# EAGLE design uMatrixPCB_r1 (EAGLE 6.5.0)
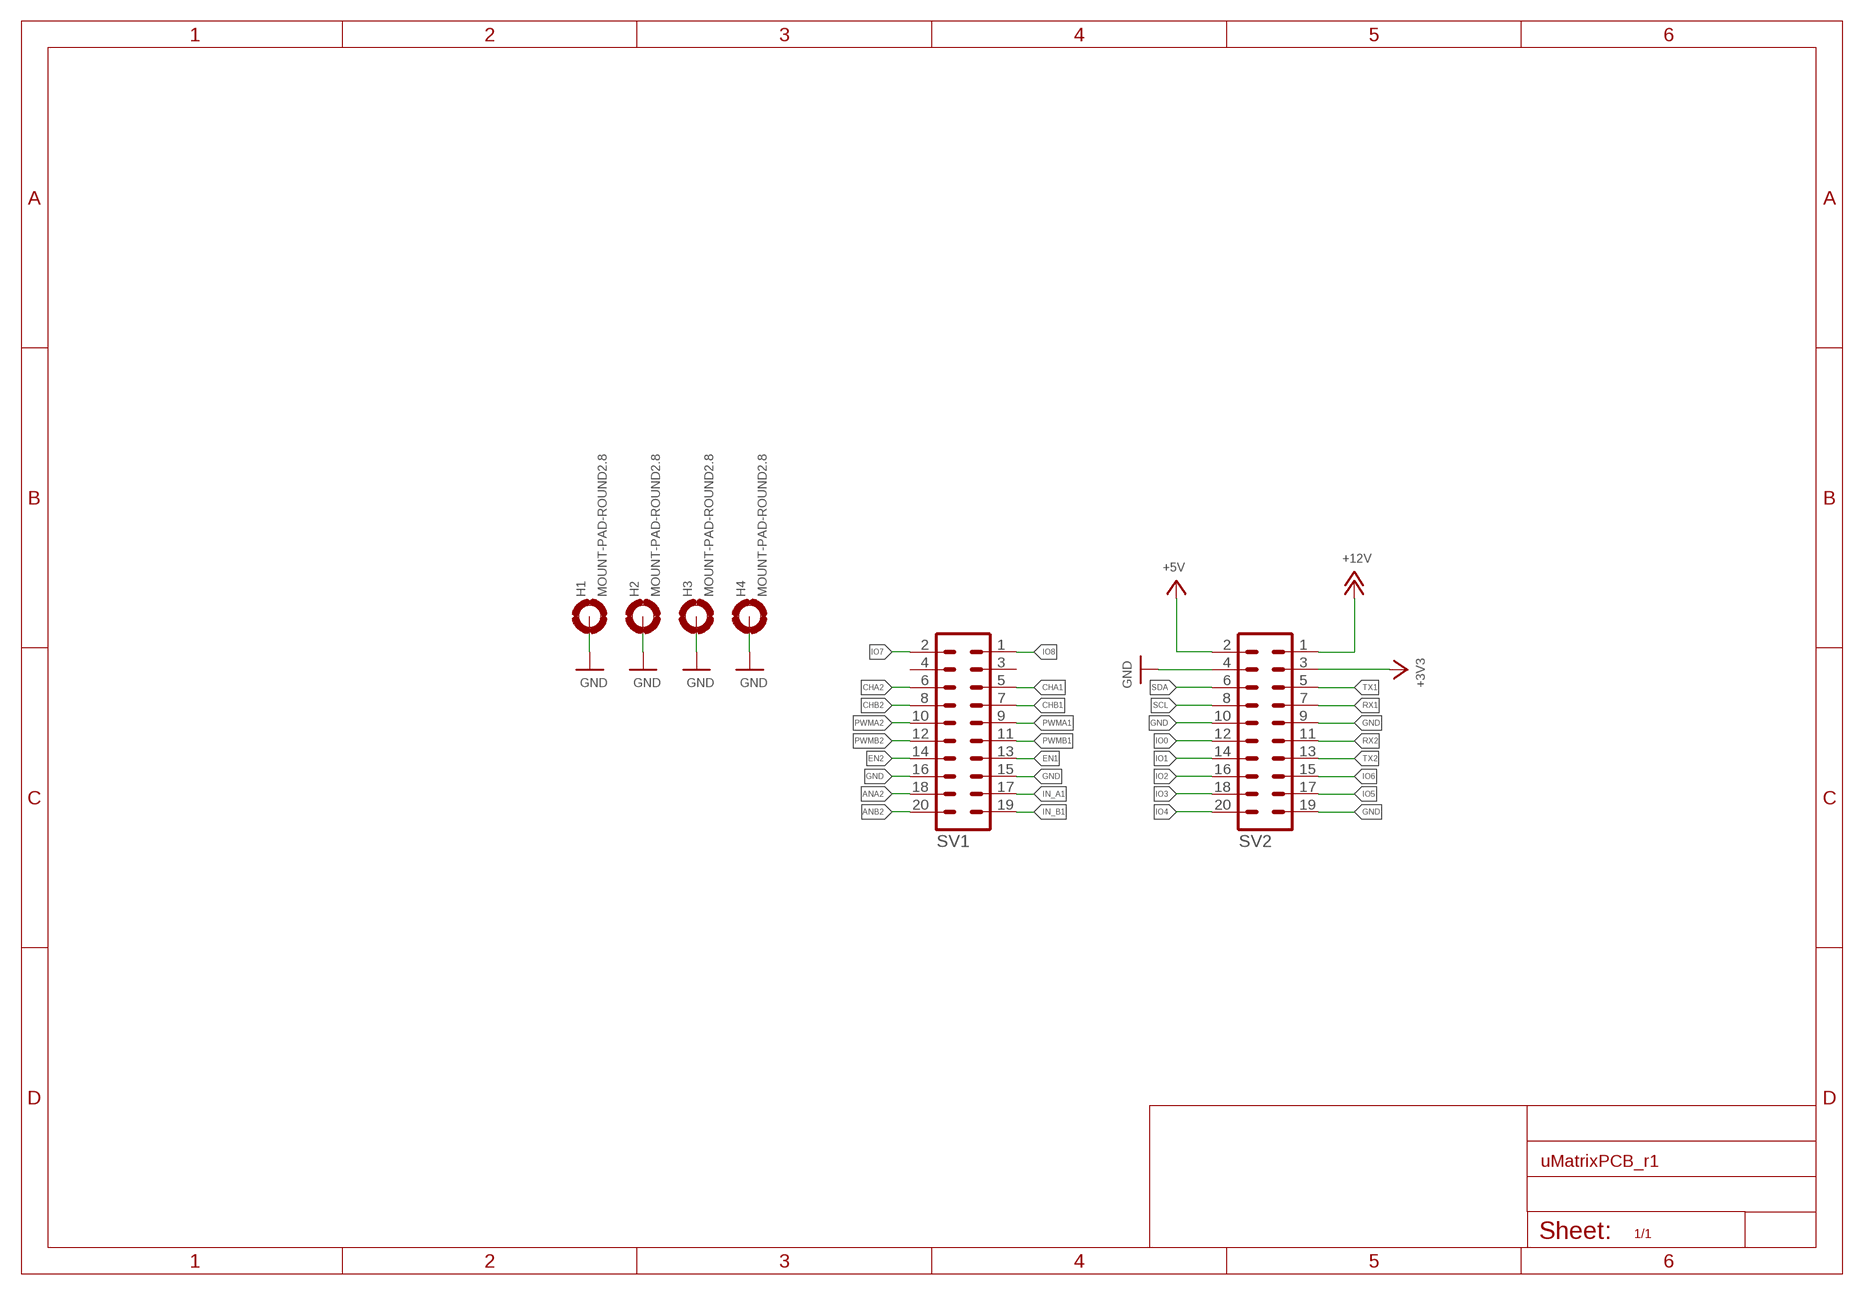
[diagram p0: schematic, sheet 1]

## Parts
H1  MOUNT-PAD-ROUND2.8  [2,8-PAD]
H2  MOUNT-PAD-ROUND2.8  [2,8-PAD]
H3  MOUNT-PAD-ROUND2.8  [2,8-PAD]
H4  MOUNT-PAD-ROUND2.8  [2,8-PAD]
SV1  MA10-2  [MA10-2]
SV2  MA10-2  [MA10-2]

## Nets
+3V3: SV2.3
+5V: SV2.2
+12V: SV2.1
ANA2: SV1.18
ANB2: SV1.20
CHA1: SV1.5
CHA2: SV1.6
CHB1: SV1.7
CHB2: SV1.8
EN1: SV1.13
EN2: SV1.14
GND: H1.B2,8(MOUNT) H2.B2,8(MOUNT) H3.B2,8(MOUNT) H4.B2,8(MOUNT) SV1.15 SV1.16 SV2.4 SV2.9 SV2.10 SV2.19
IN_A1: SV1.17
IN_B1: SV1.19
IO0: SV2.12
IO1: SV2.14
IO2: SV2.16
IO3: SV2.18
IO4: SV2.20
IO5: SV2.17
IO6: SV2.15
IO7: SV1.2
IO8: SV1.1
PWMA1: SV1.9
PWMA2: SV1.10
PWMB1: SV1.11
PWMB2: SV1.12
RX1: SV2.7
RX2: SV2.11
SCL: SV2.8
SDA: SV2.6
TX1: SV2.5
TX2: SV2.13
Unconnected: SV1.3 SV1.4

## Library data of the parts
H1-H4 = holes:MOUNT-PAD-ROUND: MOUNTING PAD, round
SV1 SV2 = con-lstb:MA10-2: PIN HEADER; OC_FARNELL: unknown; OC_NEWARK: unknown

## Net classes
0 default: width 0.254 mm, drill 0.406 mm, clearance 0.178 mm
1 power: width 0.305 mm, drill 0.406 mm, clearance 0.203 mm

## Board
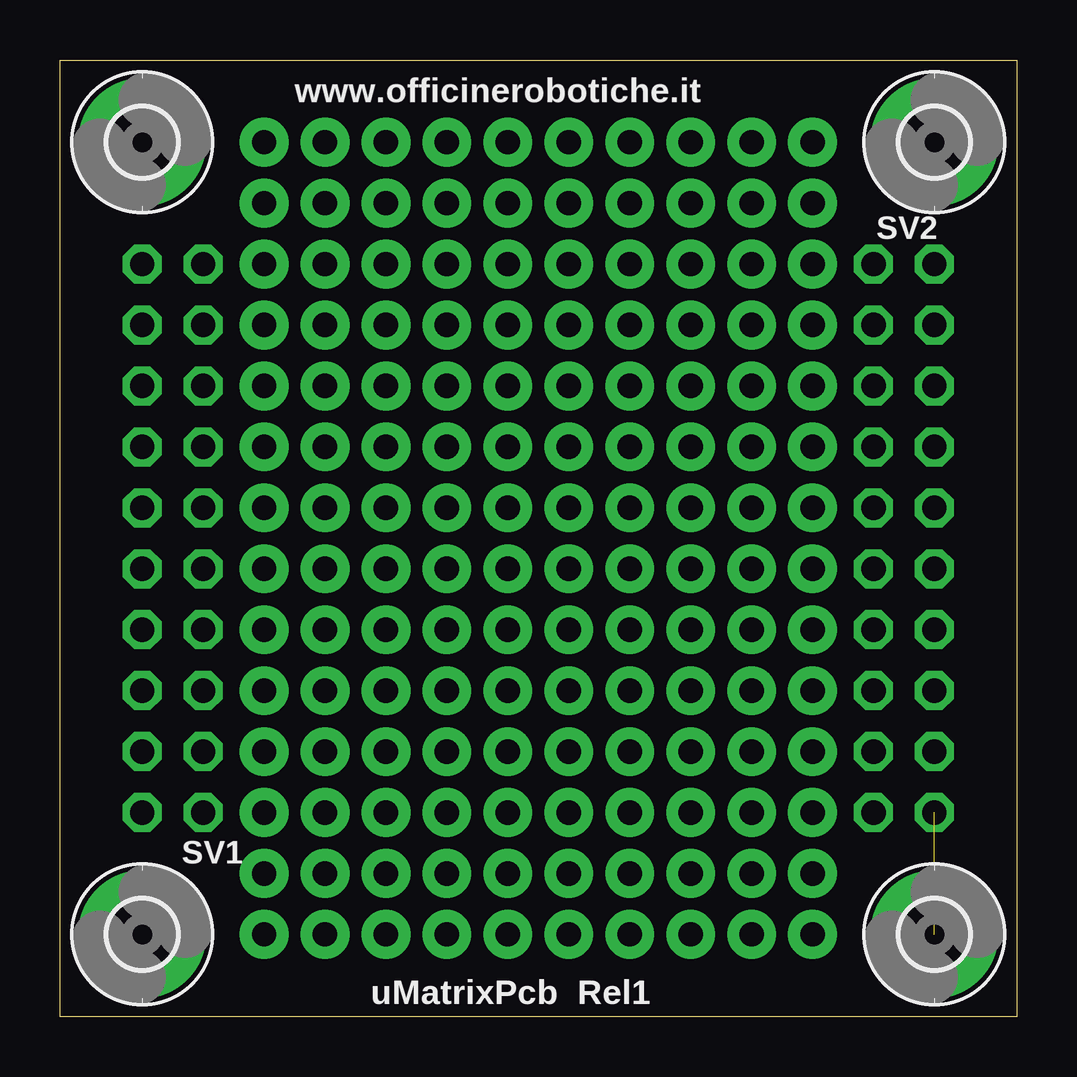
[diagram p1: board, top side]
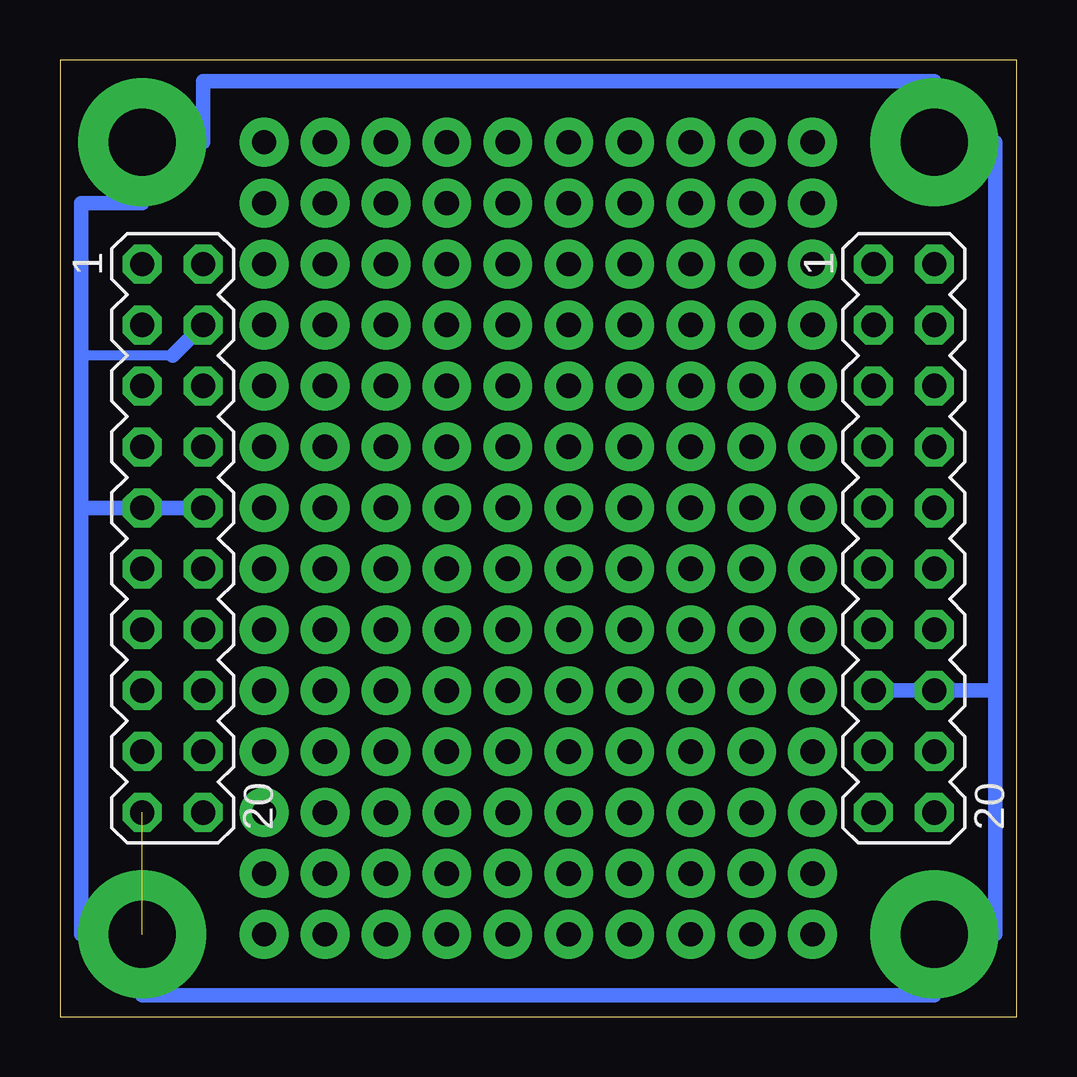
[diagram p2: board, bottom side, seen from below]

Size 39.88 x 39.88 mm. Coordinates in mm from the lower left corner, seen from the top.
Outline: 39.88,0 0,0 0,39.88 39.88,39.88 39.88,0
Copper layers (1*16): Top 0.035mm / dielectric 1.5mm / Bottom 0.035mm
Design rules "default": minimum track width 8mil, minimum drill 12mil, track to track 8mil, track to pad 8mil, pad to pad 8mil, via to via 8mil, smd to smd 8mil, copper to edge 10mil, drill to drill 8mil, minimum pad ring 12mil, minimum via ring 8mil, stop-mask expansion 4mil, vias tented up to drill 20mil, thermal gap 10mil

### Footprints (pad centres in the part's own frame; a part is rotated, then mirrored left to right if it is on the bottom)
2,8-PAD = drill 2.8 pad 5.334: B2,8 0,0
MA10-2 = drill 1.016 octagon: 1 -11.43,-1.27; 2 -11.43,1.27; 3 -8.89,-1.27; 4 -8.89,1.27; 5 -6.35,-1.27; 6 -6.35,1.27; 7 -3.81,-1.27; 8 -3.81,1.27; 9 -1.27,-1.27; 10 -1.27,1.27; 11 1.27,-1.27; 12 1.27,1.27; 13 3.81,-1.27; 14 3.81,1.27; 15 6.35,-1.27; 16 6.35,1.27; 17 8.89,-1.27; 18 8.89,1.27; 19 11.43,-1.27; 20 11.43,1.27

### Placement (x,y rotation side)
H1  3.43,3.43 0 top
H2  36.45,3.43 0 top
H3  36.45,36.45 0 top
H4  3.43,36.45 0 top
SV1  4.7,19.94 270 bottom
SV2  35.18,19.94 270 bottom

### Tracks (layer width: path | path; a pad name or v marks a point on that pad's centre or on a via)
GND  (1 unrouted)
  Bottom 0.406: 35.18,27.56 38.99,27.56
  Bottom 0.61: 0.89,13.59 0.89,36.45 H4.B2,8 3.43,38.99 33.91,38.99 33.91,36.45 H3.B2,8 36.45,33.91 38.99,33.91 38.99,27.56 38.99,21.21 | 0.89,13.59 SV1.16 SV1.15 | 0.89,13.59 0.89,3.43 H1.B2,8 3.43,0.89 36.45,0.89 H2.B2,8 38.99,3.43 38.99,21.21 | 38.99,21.21 SV2.9 SV2.10 | SV2.4 35.18,27.56
N$1  (via drill 1.02 pad 2.03)
  other vias: 8.51,3.43
N$2  (via drill 1.02 pad 2.03)
  other vias: 11.05,3.43
N$3  (via drill 1.02 pad 2.03)
  other vias: 16.13,3.43
N$4  (via drill 1.02 pad 2.03)
  other vias: 13.59,3.43
N$5  (via drill 1.02 pad 2.03)
  other vias: 18.67,3.43
N$6  (via drill 1.02 pad 2.03)
  other vias: 21.21,3.43
N$7  (via drill 1.02 pad 2.03)
  other vias: 23.75,3.43
N$8  (via drill 1.02 pad 2.03)
  other vias: 26.29,3.43
N$9  (via drill 1.02 pad 2.03)
  other vias: 8.51,23.75
N$10  (via drill 1.02 pad 2.03)
  other vias: 8.51,26.29
N$11  (via drill 1.02 pad 2.03)
  other vias: 8.51,28.83
N$12  (via drill 1.02 pad 2.03)
  other vias: 8.51,31.37
N$13  (via drill 1.02 pad 2.03)
  other vias: 8.51,33.91
N$14  (via drill 1.02 pad 2.03)
  other vias: 8.51,36.45
N$15  (via drill 1.02 pad 2.03)
  other vias: 11.05,36.45
N$16  (via drill 1.02 pad 2.03)
  other vias: 13.59,36.45
N$17  (via drill 1.02 pad 2.03)
  other vias: 16.13,36.45
N$18  (via drill 1.02 pad 2.03)
  other vias: 18.67,36.45
N$19  (via drill 1.02 pad 2.03)
  other vias: 21.21,36.45
N$20  (via drill 1.02 pad 2.03)
  other vias: 23.75,36.45
N$21  (via drill 1.02 pad 2.03)
  other vias: 26.29,36.45
N$22  (via drill 1.02 pad 2.03)
  other vias: 28.83,36.45
N$23  (via drill 1.02 pad 2.03)
  other vias: 31.37,36.45
N$24  (via drill 1.02 pad 2.03)
  other vias: 31.37,33.91
N$25  (via drill 1.02 pad 2.03)
  other vias: 28.83,33.91
N$26  (via drill 1.02 pad 2.03)
  other vias: 26.29,33.91
N$27  (via drill 1.02 pad 2.03)
  other vias: 23.75,33.91
N$28  (via drill 1.02 pad 2.03)
  other vias: 21.21,33.91
N$29  (via drill 1.02 pad 2.03)
  other vias: 16.13,33.91
N$30  (via drill 1.02 pad 2.03)
  other vias: 18.67,33.91
N$31  (via drill 1.02 pad 2.03)
  other vias: 13.59,33.91
N$32  (via drill 1.02 pad 2.03)
  other vias: 11.05,33.91
N$33  (via drill 1.02 pad 2.03)
  other vias: 11.05,31.37
N$34  (via drill 1.02 pad 2.03)
  other vias: 13.59,31.37
N$35  (via drill 1.02 pad 2.03)
  other vias: 16.13,31.37
N$36  (via drill 1.02 pad 2.03)
  other vias: 18.67,31.37
N$37  (via drill 1.02 pad 2.03)
  other vias: 21.21,31.37
N$38  (via drill 1.02 pad 2.03)
  other vias: 23.75,31.37
N$39  (via drill 1.02 pad 2.03)
  other vias: 26.29,31.37
N$40  (via drill 1.02 pad 2.03)
  other vias: 28.83,31.37
N$41  (via drill 1.02 pad 2.03)
  other vias: 31.37,31.37
N$42  (via drill 1.02 pad 2.03)
  other vias: 31.37,28.83
N$43  (via drill 1.02 pad 2.03)
  other vias: 28.83,28.83
N$44  (via drill 1.02 pad 2.03)
  other vias: 26.29,28.83
N$45  (via drill 1.02 pad 2.03)
  other vias: 23.75,28.83
N$46  (via drill 1.02 pad 2.03)
  other vias: 21.21,28.83
N$47  (via drill 1.02 pad 2.03)
  other vias: 18.67,28.83
N$48  (via drill 1.02 pad 2.03)
  other vias: 16.13,28.83
N$49  (via drill 1.02 pad 2.03)
  other vias: 13.59,28.83
N$50  (via drill 1.02 pad 2.03)
  other vias: 11.05,28.83
N$51  (via drill 1.02 pad 2.03)
  other vias: 11.05,26.29
N$52  (via drill 1.02 pad 2.03)
  other vias: 16.13,26.29
N$53  (via drill 1.02 pad 2.03)
  other vias: 13.59,26.29
N$54  (via drill 1.02 pad 2.03)
  other vias: 18.67,26.29
N$55  (via drill 1.02 pad 2.03)
  other vias: 21.21,26.29
N$56  (via drill 1.02 pad 2.03)
  other vias: 23.75,26.29
N$57  (via drill 1.02 pad 2.03)
  other vias: 26.29,26.29
N$58  (via drill 1.02 pad 2.03)
  other vias: 28.83,26.29
N$59  (via drill 1.02 pad 2.03)
  other vias: 31.37,26.29
N$60  (via drill 1.02 pad 2.03)
  other vias: 31.37,23.75
N$61  (via drill 1.02 pad 2.03)
  other vias: 28.83,23.75
N$62  (via drill 1.02 pad 2.03)
  other vias: 23.75,23.75
N$63  (via drill 1.02 pad 2.03)
  other vias: 21.21,23.75
N$64  (via drill 1.02 pad 2.03)
  other vias: 18.67,23.75
N$65  (via drill 1.02 pad 2.03)
  other vias: 16.13,23.75
N$66  (via drill 1.02 pad 2.03)
  other vias: 13.59,23.75
N$67  (via drill 1.02 pad 2.03)
  other vias: 11.05,23.75
N$68  (via drill 1.02 pad 2.03)
  other vias: 11.05,21.21
N$69  (via drill 1.02 pad 2.03)
  other vias: 13.59,21.21
N$70  (via drill 1.02 pad 2.03)
  other vias: 16.13,21.21
N$71  (via drill 1.02 pad 2.03)
  other vias: 18.67,21.21
N$72  (via drill 1.02 pad 2.03)
  other vias: 21.21,21.21
N$73  (via drill 1.02 pad 2.03)
  other vias: 23.75,21.21
N$74  (via drill 1.02 pad 2.03)
  other vias: 26.29,21.21
N$75  (via drill 1.02 pad 2.03)
  other vias: 26.29,23.75
N$76  (via drill 1.02 pad 2.03)
  other vias: 28.83,21.21
N$77  (via drill 1.02 pad 2.03)
  other vias: 31.37,21.21
N$78  (via drill 1.02 pad 2.03)
  other vias: 28.83,3.43
N$79  (via drill 1.02 pad 2.03)
  other vias: 31.37,3.43
N$80  (via drill 1.02 pad 2.03)
  other vias: 31.37,5.97
N$81  (via drill 1.02 pad 2.03)
  other vias: 31.37,8.51
N$82  (via drill 1.02 pad 2.03)
  other vias: 31.37,11.05
N$83  (via drill 1.02 pad 2.03)
  other vias: 31.37,13.59
N$84  (via drill 1.02 pad 2.03)
  other vias: 31.37,18.67
N$85  (via drill 1.02 pad 2.03)
  other vias: 31.37,16.13
N$86  (via drill 1.02 pad 2.03)
  other vias: 28.83,16.13
N$87  (via drill 1.02 pad 2.03)
  other vias: 28.83,18.67
N$88  (via drill 1.02 pad 2.03)
  other vias: 28.83,13.59
N$89  (via drill 1.02 pad 2.03)
  other vias: 28.83,11.05
N$90  (via drill 1.02 pad 2.03)
  other vias: 28.83,8.51
N$91  (via drill 1.02 pad 2.03)
  other vias: 28.83,5.97
N$92  (via drill 1.02 pad 2.03)
  other vias: 26.29,5.97
N$93  (via drill 1.02 pad 2.03)
  other vias: 26.29,8.51
N$94  (via drill 1.02 pad 2.03)
  other vias: 26.29,11.05
N$95  (via drill 1.02 pad 2.03)
  other vias: 26.29,13.59
N$96  (via drill 1.02 pad 2.03)
  other vias: 26.29,16.13
N$97  (via drill 1.02 pad 2.03)
  other vias: 26.29,18.67
N$98  (via drill 1.02 pad 2.03)
  other vias: 23.75,18.67
N$99  (via drill 1.02 pad 2.03)
  other vias: 23.75,16.13
N$100  (via drill 1.02 pad 2.03)
  other vias: 23.75,13.59
N$101  (via drill 1.02 pad 2.03)
  other vias: 23.75,11.05
N$102  (via drill 1.02 pad 2.03)
  other vias: 23.75,8.51
N$103  (via drill 1.02 pad 2.03)
  other vias: 23.75,5.97
N$104  (via drill 1.02 pad 2.03)
  other vias: 21.21,5.97
N$105  (via drill 1.02 pad 2.03)
  other vias: 21.21,8.51
N$106  (via drill 1.02 pad 2.03)
  other vias: 21.21,11.05
N$107  (via drill 1.02 pad 2.03)
  other vias: 21.21,13.59
N$108  (via drill 1.02 pad 2.03)
  other vias: 21.21,16.13
N$109  (via drill 1.02 pad 2.03)
  other vias: 21.21,18.67
N$110  (via drill 1.02 pad 2.03)
  other vias: 11.05,18.67
N$111  (via drill 1.02 pad 2.03)
  other vias: 11.05,13.59
N$112  (via drill 1.02 pad 2.03)
  other vias: 11.05,11.05
N$113  (via drill 1.02 pad 2.03)
  other vias: 11.05,8.51
N$114  (via drill 1.02 pad 2.03)
  other vias: 11.05,5.97
N$115  (via drill 1.02 pad 2.03)
  other vias: 8.51,5.97
N$116  (via drill 1.02 pad 2.03)
  other vias: 8.51,8.51
N$117  (via drill 1.02 pad 2.03)
  other vias: 8.51,11.05
N$118  (via drill 1.02 pad 2.03)
  other vias: 8.51,13.59
N$119  (via drill 1.02 pad 2.03)
  other vias: 8.51,16.13
N$120  (via drill 1.02 pad 2.03)
  other vias: 8.51,18.67
N$121  (via drill 1.02 pad 2.03)
  other vias: 8.51,21.21
N$122  (via drill 1.02 pad 2.03)
  other vias: 11.05,16.13
N$123  (via drill 1.02 pad 2.03)
  other vias: 13.59,18.67
N$124  (via drill 1.02 pad 2.03)
  other vias: 13.59,16.13
N$125  (via drill 1.02 pad 2.03)
  other vias: 13.59,13.59
N$126  (via drill 1.02 pad 2.03)
  other vias: 13.59,11.05
N$127  (via drill 1.02 pad 2.03)
  other vias: 13.59,8.51
N$128  (via drill 1.02 pad 2.03)
  other vias: 13.59,5.97
N$129  (via drill 1.02 pad 2.03)
  other vias: 16.13,5.97
N$130  (via drill 1.02 pad 2.03)
  other vias: 16.13,8.51
N$131  (via drill 1.02 pad 2.03)
  other vias: 18.67,8.51
N$132  (via drill 1.02 pad 2.03)
  other vias: 18.67,5.97
N$133  (via drill 1.02 pad 2.03)
  other vias: 18.67,11.05
N$134  (via drill 1.02 pad 2.03)
  other vias: 18.67,13.59
N$135  (via drill 1.02 pad 2.03)
  other vias: 18.67,16.13
N$136  (via drill 1.02 pad 2.03)
  other vias: 18.67,18.67
N$137  (via drill 1.02 pad 2.03)
  other vias: 16.13,18.67
N$138  (via drill 1.02 pad 2.03)
  other vias: 16.13,16.13
N$139  (via drill 1.02 pad 2.03)
  other vias: 16.13,13.59
N$140  (via drill 1.02 pad 2.03)
  other vias: 16.13,11.05

### Text on the board
tPlace: www.officinerobotiche.it | uMatrixPcb Rel1